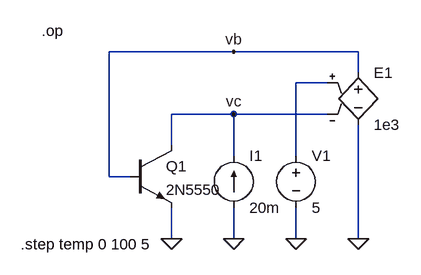
[diagram p0: schematic vbe_t_dependency.asc]
vbe_t_dependency.asc, the LTspice schematic file:
Version 4
SHEET 1 880 680
WIRE 320 -32 128 -32
WIRE 512 -32 320 -32
WIRE 512 0 512 -32
WIRE 464 16 416 16
WIRE 320 64 224 64
WIRE 464 64 320 64
WIRE 224 112 224 64
WIRE 320 128 320 64
WIRE 416 128 416 16
WIRE 128 160 128 -32
WIRE 160 160 128 160
WIRE 224 256 224 208
WIRE 320 256 320 208
WIRE 416 256 416 208
WIRE 512 256 512 80
FLAG 224 256 0
FLAG 320 256 0
FLAG 512 256 0
FLAG 416 256 0
FLAG 320 64 vc
FLAG 320 -32 vb
SYMBOL npn 160 112 R0
SYMATTR InstName Q1
SYMATTR Value 2N5550
SYMBOL current 320 208 M180
WINDOW 0 24 80 Left 2
WINDOW 3 24 0 Left 2
WINDOW 123 0 0 Left 0
WINDOW 39 0 0 Left 0
SYMATTR InstName I1
SYMATTR Value 20m
SYMBOL e 512 -16 R0
SYMATTR InstName E1
SYMATTR Value 1e3
SYMBOL voltage 416 112 R0
WINDOW 123 0 0 Left 0
WINDOW 39 0 0 Left 0
SYMATTR InstName V1
SYMATTR Value 5
TEXT 24 -64 Left 2 !.op
TEXT -8 264 Left 2 !.step temp 0 100 5

The netlist it stands for:
* vbe_t_dependency.asc
Q1 vc vb 0 0 2N5550
I1 0 vc 20m
E1 vb 0 N001 vc 1e3
V1 N001 0 5
.model NPN NPN
.model PNP PNP
.lib standard.bjt
.op
.step temp 0 100 5
.backanno
.end